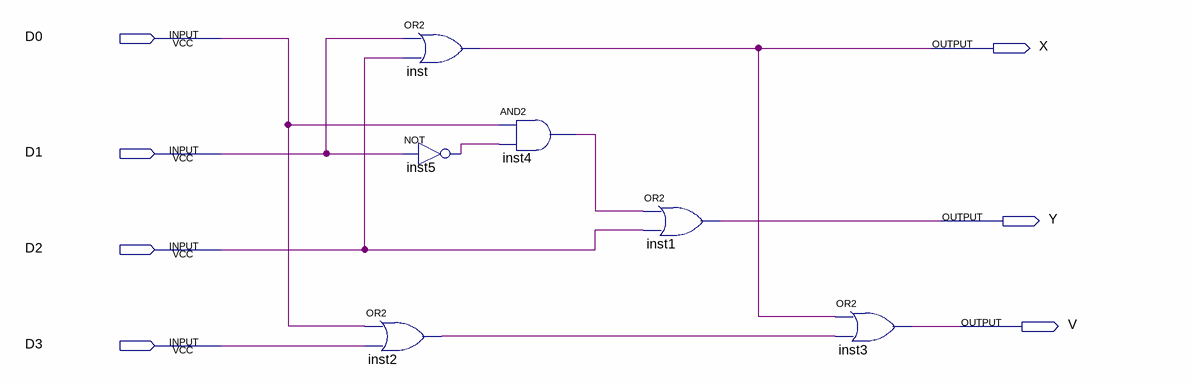
[diagram p0: schematic sheet]
// Quartus schematic EN.bdf as structural Verilog: 6 symbols, 7 pins
module EN (
  input  D0,
  input  D1,
  input  D2,
  input  D3,
  output X,
  output Y,
  output V
);

  wire inst2_out, inst4_out, inst5_out;

  or inst (X, D1, D2);
  not inst5 (inst5_out, D1);
  or inst2 (inst2_out, D0, D3);
  and inst4 (inst4_out, D0, inst5_out);
  or inst1 (Y, inst4_out, D2);
  or inst3 (V, X, inst2_out);
endmodule
